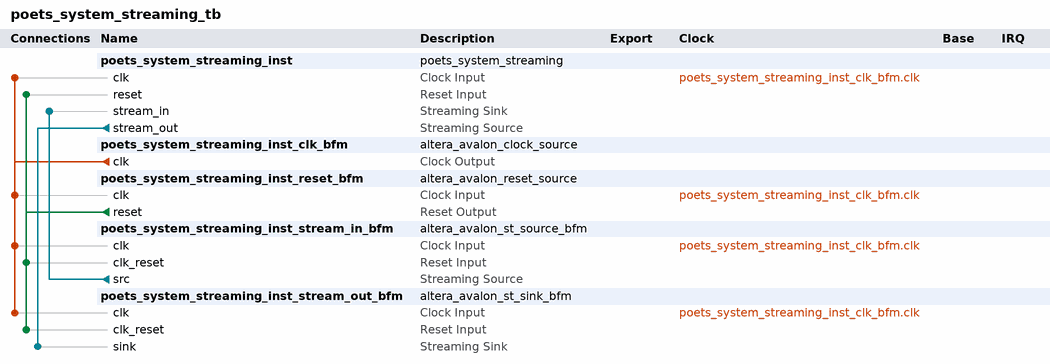
[diagram p0: system contents]
# Platform Designer (Qsys) system poets_system_streaming_tb, Cyclone V 5CSEMA5F31C6
# Parameters at their usual value, and those the tool derives, are not listed.
package require -exact qsys 16.1
create_system poets_system_streaming_tb
set_project_property DEVICE_FAMILY {Cyclone V}
set_project_property DEVICE 5CSEMA5F31C6

add_instance poets_system_streaming_inst poets_system_streaming 1.0

add_instance poets_system_streaming_inst_clk_bfm altera_avalon_clock_source 16.1

add_instance poets_system_streaming_inst_reset_bfm altera_avalon_reset_source 16.1
set_instance_parameter_value poets_system_streaming_inst_reset_bfm ASSERT_HIGH_RESET 0
set_instance_parameter_value poets_system_streaming_inst_reset_bfm INITIAL_RESET_CYCLES 50

add_instance poets_system_streaming_inst_stream_in_bfm altera_avalon_st_source_bfm 16.1
set_instance_parameter_value poets_system_streaming_inst_stream_in_bfm ST_CHANNEL_W 1
set_instance_parameter_value poets_system_streaming_inst_stream_in_bfm ST_ERROR_W 1
set_instance_parameter_value poets_system_streaming_inst_stream_in_bfm ST_MAX_CHANNELS 0
set_instance_parameter_value poets_system_streaming_inst_stream_in_bfm ST_NUMSYMBOLS 4
set_instance_parameter_value poets_system_streaming_inst_stream_in_bfm ST_READY_LATENCY 1
set_instance_parameter_value poets_system_streaming_inst_stream_in_bfm ST_SYMBOL_W 8
set_instance_parameter_value poets_system_streaming_inst_stream_in_bfm USE_CHANNEL 0
set_instance_parameter_value poets_system_streaming_inst_stream_in_bfm USE_EMPTY 1
set_instance_parameter_value poets_system_streaming_inst_stream_in_bfm USE_ERROR 0
set_instance_parameter_value poets_system_streaming_inst_stream_in_bfm USE_PACKET 1
set_instance_parameter_value poets_system_streaming_inst_stream_in_bfm USE_READY 1
set_instance_parameter_value poets_system_streaming_inst_stream_in_bfm USE_VALID 1

add_instance poets_system_streaming_inst_stream_out_bfm altera_avalon_st_sink_bfm 16.1
set_instance_parameter_value poets_system_streaming_inst_stream_out_bfm ST_CHANNEL_W 1
set_instance_parameter_value poets_system_streaming_inst_stream_out_bfm ST_ERROR_W 1
set_instance_parameter_value poets_system_streaming_inst_stream_out_bfm ST_MAX_CHANNELS 0
set_instance_parameter_value poets_system_streaming_inst_stream_out_bfm ST_NUMSYMBOLS 4
set_instance_parameter_value poets_system_streaming_inst_stream_out_bfm ST_READY_LATENCY 1
set_instance_parameter_value poets_system_streaming_inst_stream_out_bfm ST_SYMBOL_W 8
set_instance_parameter_value poets_system_streaming_inst_stream_out_bfm USE_CHANNEL 0
set_instance_parameter_value poets_system_streaming_inst_stream_out_bfm USE_EMPTY 1
set_instance_parameter_value poets_system_streaming_inst_stream_out_bfm USE_ERROR 0
set_instance_parameter_value poets_system_streaming_inst_stream_out_bfm USE_PACKET 1
set_instance_parameter_value poets_system_streaming_inst_stream_out_bfm USE_READY 1
set_instance_parameter_value poets_system_streaming_inst_stream_out_bfm USE_VALID 1
set_instance_parameter_value poets_system_streaming_inst_stream_out_bfm VHDL_ID 0

# connections
add_connection poets_system_streaming_inst_clk_bfm.clk poets_system_streaming_inst.clk clock
add_connection poets_system_streaming_inst_clk_bfm.clk poets_system_streaming_inst_reset_bfm.clk clock
add_connection poets_system_streaming_inst_clk_bfm.clk poets_system_streaming_inst_stream_in_bfm.clk clock
add_connection poets_system_streaming_inst_clk_bfm.clk poets_system_streaming_inst_stream_out_bfm.clk clock
add_connection poets_system_streaming_inst_reset_bfm.reset poets_system_streaming_inst.reset reset
add_connection poets_system_streaming_inst_reset_bfm.reset poets_system_streaming_inst_stream_in_bfm.clk_reset reset
add_connection poets_system_streaming_inst_reset_bfm.reset poets_system_streaming_inst_stream_out_bfm.clk_reset reset
add_connection poets_system_streaming_inst.stream_out poets_system_streaming_inst_stream_out_bfm.sink avalon_streaming
add_connection poets_system_streaming_inst_stream_in_bfm.src poets_system_streaming_inst.stream_in avalon_streaming

set_interconnect_requirement {$system} qsys_mm.clockCrossingAdapter HANDSHAKE
set_interconnect_requirement {$system} qsys_mm.enableEccProtection FALSE
set_interconnect_requirement {$system} qsys_mm.insertDefaultSlave FALSE
set_interconnect_requirement {$system} qsys_mm.maxAdditionalLatency 1

save_system poets_system_streaming_tb.qsys
